# Altium schematic sheet PowerDetector.SchDoc
size 292 x 193 mm; DocumentNumber: 6; SheetNumber: 6; SheetTotal: 11
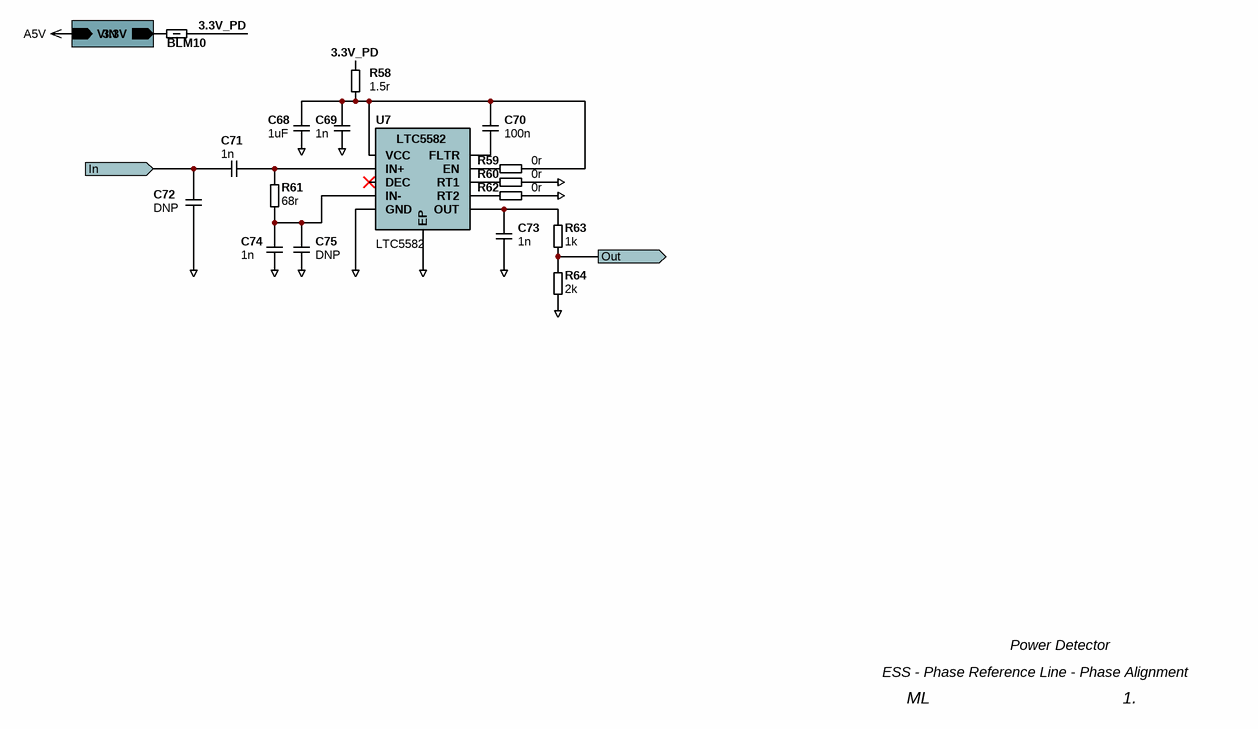
[diagram p0: PowerDetector.SchDoc]

## Parts
BLM10  120 Ohms @ 100MHz  [0402-Inductor]  (value not drawn)
C68  1uF  [0805-Capacitor]
C69  1n  [0603-Capacitor]
C70  100n  [0603-Capacitor]
C71  1n  [0402-Capacitor]
C72  DNP  [0402-Capacitor]  (no BOM)
C73  1n  [0402-Capacitor]
C74  1n  [0402-Capacitor]
C75  DNP  [0402-Capacitor]  (no BOM)
R58  1.5r  [0603-RESISTOR]
R59  0r  [0402-RESISTOR]
R60  0r  [0402-RESISTOR]
R61  68r  [0402-RESISTOR]
R62  0r  [0402-RESISTOR]
R63  1k  [0402-RESISTOR]
R64  2k  [0402-RESISTOR]
U7  LTC5582  [LT-DFN10]

## Sub-sheets
A3.3V_PD = LDO3v3.SchDoc: 3.3V (out), VIN (in)

## Ports
In (in), Out (out)

## Nets
A5V: sheet A3.3V_PD/VIN
GND: C68.2 C69.2 C72.2 C73.2 C74.2 C75.2 R60.1 R62.1 R64.2 U7.5(GND) U7.11(EP)
3.3V_PD: BLM10.1 R58.2
In: C71.1 C72.1 ; port In
Out: R63.2 R64.1 ; port Out
NetBLM10_2: BLM10.2 ; sheet A3.3V_PD/3.3V
NetC68_1: C68.1 C69.1 C70.1 R58.1 R59.1 U7.1(VCC)
NetC70_2: C70.2 U7.10(FLTR)
NetC71_2: C71.2 R61.1 U7.2(IN+)
NetC73_1: C73.1 R63.1 U7.6(OUT)
NetC74_1: C74.1 C75.1 R61.2 U7.4(IN-)
NetR59_2: R59.2 U7.9(EN)
NetR60_2: R60.2 U7.8(RT1)
NetR62_2: R62.2 U7.7(RT2)

Not connected (* = marked no-connect by the designer): U7 3(DEC)*

## Notes on the sheet
- ESS - Phase Reference Line - Phase Alignment
- Power Detector
- ML
- 1.
- Title
- Project
- Drawing no.
- Date
- Drawn by
- Checked by
- Revision

## Library data of the parts
BLM10 = BLM15AX121SZ1D: 120 Ohms @ 100MHz 1 Power, Signal Line Ferrite Bead 0402 (1005 Metric) 700mA 130mOhm; Case: 0402; Supplier 1: Digi-Key; Supplier Part Number 1: 490-16510-1-ND; HelpURL: https://www.murata.com/en-us/products/productdata/8796748677150/QNFA9118.pdf
C68 = C_0805: Capacitor 0805; Tolerance: ±20%; Voltage Rating: 16V; Dielectric: X7R/C0G; Value: 1uF; Case: 0805
C69 C70 = C_0603: Capacitor 0603; Tolerance: ±20%; Voltage Rating: 16V; Dielectric: X7R/C0G; Case: 0603
  C69: Value: 1n
  C70: Value: 100n
C71-C75 = C_0402: Capacitor 0402; Tolerance: ±20%; Voltage Rating: 16V; Dielectric: X7R/C0G; Case: 0402
  C71 C73 C74: Value: 1n
  C72 C75: Value: DNP
R58 = R_0603: Resistor 0603; Tolerance: ±1%; Value: 1.5r; Case: 0603
R59-R64 = R_0402: Resistor 0402; Tolerance: ±1%; Case: 0402
  R59 R60 R62: Value: 0r
  R61: Value: 68r
  R63: Value: 1k
  R64: Value: 2k
U7 = LTC5582: 40MHz to 10GHz RMS Power Detector with 57dB Dynamic Range; HelpURL: https://www.analog.com/media/en/technical-documentation/data-sheets/LTC5582.pdf; Supplier 1: DigiKey; Supplier Part Number 1: LTC5582IDD#PBF-ND